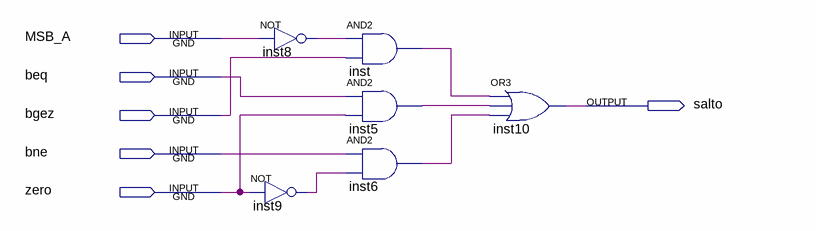
[diagram p0: schematic sheet]
// Quartus schematic SaltaOuNaoSalta.bdf as structural Verilog: 6 symbols, 6 pins
module SaltaOuNaoSalta (
  input  MSB_A,
  input  beq,
  input  bgez,
  input  bne,
  input  zero,
  output salto
);

  wire inst5_out, inst6_out, inst8_out, inst9_out, inst_out;

  not inst8 (inst8_out, MSB_A);
  not inst9 (inst9_out, zero);
  and inst (inst_out, inst8_out, bgez);
  and inst5 (inst5_out, beq, zero);
  and inst6 (inst6_out, bne, inst9_out);
  or inst10 (salto, inst_out, inst5_out, inst6_out);
endmodule
